# EAGLE design C64_3 (EAGLE 5.12)

## Sheet 1 of 3
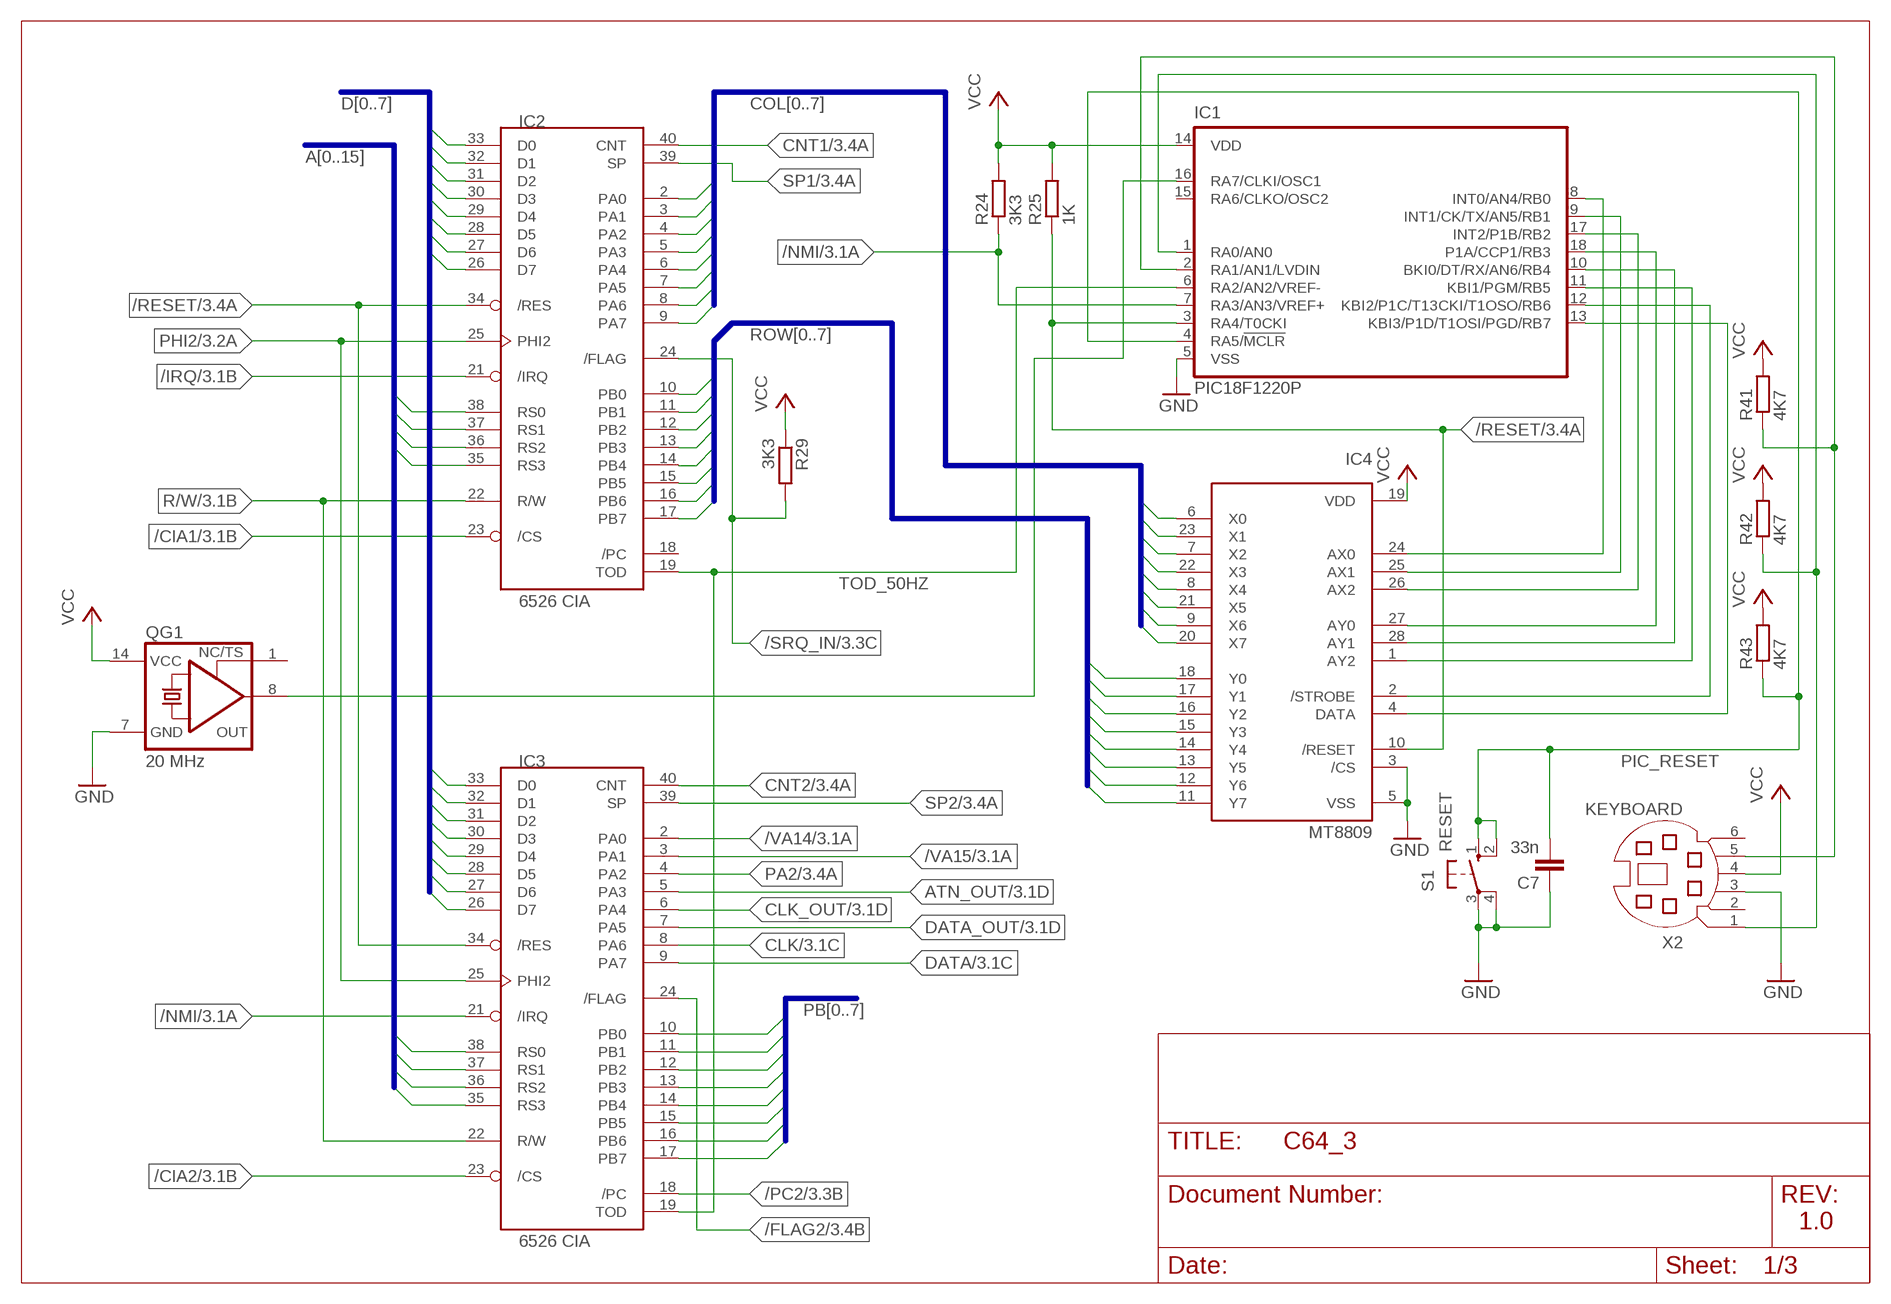
[diagram p0: schematic, sheet 1]

### Parts
C7  33n  C-EU050-024X044  [C050-024X044]
IC1  PIC18F1220P  [DIL18]
IC2  6526 CIA  6526  [DIP40]
IC3  6526 CIA  6526  [DIP40]
IC4  MT8809  [S28]
QG1  20 MHz  XO-14  [DIL14S]
R24  3K3  R-EU_0207/2V  [0207/2V]
R25  1K  R-EU_0207/2V  [0207/2V]
R29  3K3  R-EU_0207/2V  [0207/2V]
R41  4K7  R-EU_0207/2V  [0207/2V]
R42  4K7  R-EU_0207/2V  [0207/2V]
R43  4K7  R-EU_0207/2V  [0207/2V]
S1  RESET  10-XX  [B3F-10XX]
X2  KEYBOARD  MD06SS  [MDIN06SS]

### Nets
/CIA1: IC2.23(/CS) ; also sheet 3
/CIA2: IC3.23(/CS) ; also sheet 3
/FLAG2: IC3.24(/FLAG) ; also sheet 3
/IRQ: IC2.21(/IRQ) ; also sheet 3
/NMI: IC1.7(RA3/AN3/VREF+) IC3.21(/IRQ) R24.1 ; also sheet 3
/PC2: IC3.18(/PC) ; also sheet 3
/RESET: IC1.3(RA4/T0CKI) IC2.34(/RES) IC3.34(/RES) IC4.10(/RESET) R25.1 ; also sheet 3
/SRQ_IN: IC2.24(/FLAG) R29.2 ; also sheet 3
/STROBE: IC1.12(KBI2/P1C/T13CKI/T1OSO/RB6) IC4.2(/STROBE)
/VA14: IC3.2(PA0) ; also sheet 3
/VA15: IC3.3(PA1) ; also sheet 3
A0: IC2.38(RS0) IC3.38(RS0) ; also sheet 3
A1: IC2.37(RS1) IC3.37(RS1) ; also sheet 3
A2: IC2.36(RS2) IC3.36(RS2) ; also sheet 3
A3: IC2.35(RS3) IC3.35(RS3) ; also sheet 3
ATN_OUT: IC3.5(PA3) ; also sheet 3
AX0: IC1.8(INT0/AN4/RB0) IC4.24(AX0)
AX1: IC1.9(INT1/CK/TX/AN5/RB1) IC4.25(AX1)
AX2: IC1.17(INT2/P1B/RB2) IC4.26(AX2)
AY0: IC1.18(P1A/CCP1/RB3) IC4.27(AY0)
AY1: IC1.10(BKI0/DT/RX/AN6/RB4) IC4.28(AY1)
AY2: IC1.11(KBI1/PGM/RB5) IC4.1(AY2)
CLK: IC3.8(PA6) ; also sheet 3
CLK_OUT: IC3.6(PA4) ; also sheet 3
CNT1: IC2.40(CNT) ; also sheet 3
CNT2: IC3.40(CNT) ; also sheet 3
COL0: IC2.2(PA0) IC4.6(X0) ; also sheet 2
COL1: IC2.3(PA1) IC4.23(X1) ; also sheet 2
COL2: IC2.4(PA2) IC4.7(X2) ; also sheet 2
COL3: IC2.5(PA3) IC4.22(X3) ; also sheet 2
COL4: IC2.6(PA4) IC4.8(X4) ; also sheet 2
COL5: IC2.7(PA5) IC4.21(X5)
COL6: IC2.8(PA6) IC4.9(X6) ; also sheet 2
COL7: IC2.9(PA7) IC4.20(X7) ; also sheet 2
D0: IC2.33(D0) IC3.33(D0) ; also sheet 3
D1: IC2.32(D1) IC3.32(D1) ; also sheet 3
D2: IC2.31(D2) IC3.31(D2) ; also sheet 3
D3: IC2.30(D3) IC3.30(D3) ; also sheet 3
D4: IC2.29(D4) IC3.29(D4) ; also sheet 3
D5: IC2.28(D5) IC3.28(D5) ; also sheet 3
D6: IC2.27(D6) IC3.27(D6) ; also sheet 3
D7: IC2.26(D7) IC3.26(D7) ; also sheet 3
DATA: IC3.9(PA7) ; also sheet 3
DATA_OUT: IC3.7(PA5) ; also sheet 3
GND: C7.1 IC1.5(VSS) IC4.3(/CS) IC4.5(VSS) QG1.7(GND) S1.3(P) S1.4(P1) X2.3 ; also sheet 2,3
KB_CLOCK: IC1.2(RA1/AN1/LVDIN) R41.1 X2.5
KB_DATA: IC1.1(RA0/AN0) R42.1 X2.1
PA2: IC3.4(PA2) ; also sheet 3
PB0: IC3.10(PB0) ; also sheet 3
PB1: IC3.11(PB1) ; also sheet 3
PB2: IC3.12(PB2) ; also sheet 3
PB3: IC3.13(PB3) ; also sheet 3
PB4: IC3.14(PB4) ; also sheet 3
PB5: IC3.15(PB5) ; also sheet 3
PB6: IC3.16(PB6) ; also sheet 3
PB7: IC3.17(PB7) ; also sheet 3
PHI2: IC2.25(PHI2) IC3.25(PHI2) ; also sheet 3
PIC_CLK: IC1.16(RA7/CLKI/OSC1) QG1.8(OUT)
PIC_RESET: C7.2 IC1.4(RA5/!MCLR) R43.1 S1.1(S) S1.2(S1)
R/W: IC2.22(R/W) IC3.22(R/W) ; also sheet 3
ROW0: IC2.10(PB0) IC4.18(Y0) ; also sheet 2
ROW1: IC2.11(PB1) IC4.17(Y1) ; also sheet 2
ROW2: IC2.12(PB2) IC4.16(Y2) ; also sheet 2
ROW3: IC2.13(PB3) IC4.15(Y3) ; also sheet 2
ROW4: IC2.14(PB4) IC4.14(Y4) ; also sheet 2,3
ROW5: IC2.15(PB5) IC4.13(Y5)
ROW6: IC2.16(PB6) IC4.12(Y6)
ROW7: IC2.17(PB7) IC4.11(Y7)
SP1: IC2.39(SP) ; also sheet 3
SP2: IC3.39(SP) ; also sheet 3
SW_DATA: IC1.13(KBI3/P1D/T1OSI/PGD/RB7) IC4.4(DATA)
TOD_50HZ: IC1.6(RA2/AN2/VREF-) IC2.19(TOD) IC3.19(TOD)
VCC: IC1.14(VDD) IC4.19(VDD) QG1.14(VCC) R24.2 R25.2 R29.1 R41.2 R42.2 R43.2 X2.4 ; also sheet 2,3
Unconnected: IC1.15(RA6/CLKO/OSC2) IC2.18(/PC) QG1.1(TS) X2.2 X2.6

### Buses
D[0..7]
A[0..15]
COL[0..7]
ROW[0..7]
PB[0..7]

### Notes on the sheet
- 1.0

## Sheet 2 of 3
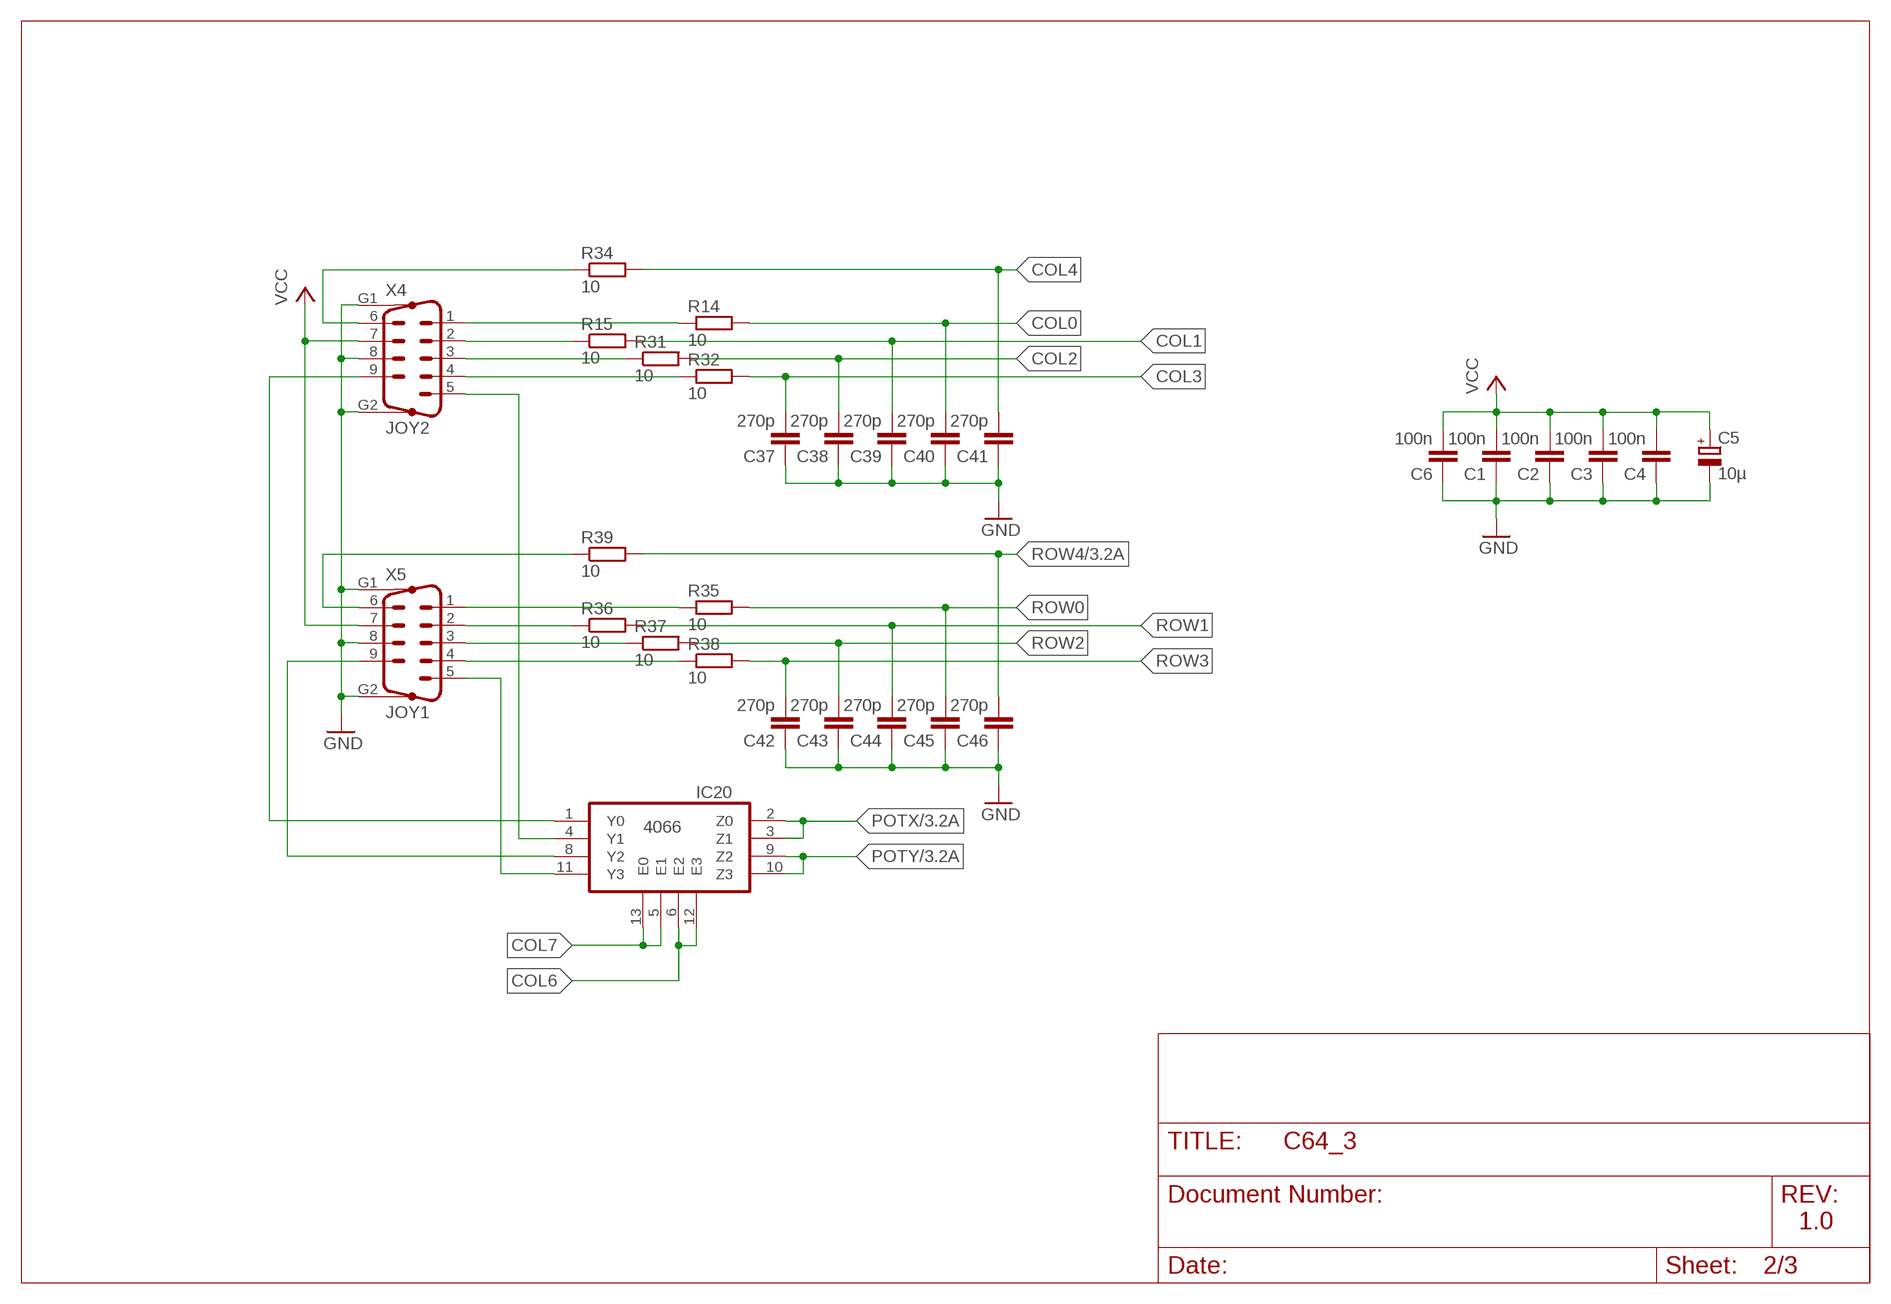
[diagram p1: schematic, sheet 2]

### Parts
C1  100n  C-EU050-024X044  [C050-024X044]
C2  100n  C-EU050-024X044  [C050-024X044]
C3  100n  C-EU050-024X044  [C050-024X044]
C4  100n  C-EU050-024X044  [C050-024X044]
C5  10µ  CPOL-EUE2.5-5  [E2,5-5]
C6  100n  C-EU050-024X044  [C050-024X044]
C37  270p  C-EU050-024X044  [C050-024X044]
C38  270p  C-EU050-024X044  [C050-024X044]
C39  270p  C-EU050-024X044  [C050-024X044]
C40  270p  C-EU050-024X044  [C050-024X044]
C41  270p  C-EU050-024X044  [C050-024X044]
C42  270p  C-EU050-024X044  [C050-024X044]
C43  270p  C-EU050-024X044  [C050-024X044]
C44  270p  C-EU050-024X044  [C050-024X044]
C45  270p  C-EU050-024X044  [C050-024X044]
C46  270p  C-EU050-024X044  [C050-024X044]
IC20  4066  [DIL14]
R14  10  R-EU_0207/2V  [0207/2V]
R15  10  R-EU_0207/2V  [0207/2V]
R31  10  R-EU_0207/2V  [0207/2V]
R32  10  R-EU_0207/2V  [0207/2V]
R34  10  R-EU_0207/2V  [0207/2V]
R35  10  R-EU_0207/2V  [0207/2V]
R36  10  R-EU_0207/2V  [0207/2V]
R37  10  R-EU_0207/2V  [0207/2V]
R38  10  R-EU_0207/2V  [0207/2V]
R39  10  R-EU_0207/2V  [0207/2V]
X4  JOY2  M09HP  [M09HP]
X5  JOY1  M09HP  [M09HP]

### Nets
BNTB: R34.1 X4.6
BTNA: R39.1 X5.6
COL0: C40.2 R14.2 ; also sheet 1
COL1: C39.2 R15.2 ; also sheet 1
COL2: C38.2 R31.2 ; also sheet 1
COL3: C37.2 R32.2 ; also sheet 1
COL4: C41.2 R34.2 ; also sheet 1
COL6: IC20.6(E2) IC20.12(E3) ; also sheet 1
COL7: IC20.5(E1) IC20.13(E0) ; also sheet 1
GND: C1.1 C2.1 C3.1 C4.1 C5.- C6.1 C37.1 C38.1 C39.1 C40.1 C41.1 C42.1 C43.1 C44.1 C45.1 C46.1 X4.8 X4.G1 X4.G2 X5.8 X5.G1 X5.G2 ; also sheet 1,3
JOYA0: R35.1 X5.1
JOYA1: R36.1 X5.2
JOYA2: R37.1 X5.3
JOYA3: R38.1 X5.4
JOYB0: R14.1 X4.1
JOYB1: R15.1 X4.2
JOYB2: R31.1 X4.3
JOYB3: R32.1 X4.4
POTAX: IC20.11(Y3) X5.5
POTAY: IC20.8(Y2) X5.9
POTBX: IC20.4(Y1) X4.5
POTBY: IC20.1(Y0) X4.9
POTX: IC20.2(Z0) IC20.3(Z1) ; also sheet 3
POTY: IC20.9(Z2) IC20.10(Z3) ; also sheet 3
ROW0: C45.2 R35.2 ; also sheet 1
ROW1: C44.2 R36.2 ; also sheet 1
ROW2: C43.2 R37.2 ; also sheet 1
ROW3: C42.2 R38.2 ; also sheet 1
ROW4: C46.2 R39.2 ; also sheet 1,3
VCC: C1.2 C2.2 C3.2 C4.2 C5.+ C6.2 X4.7 X5.7 ; also sheet 1,3

### Notes on the sheet
- 1.0

## Sheet 3 of 3
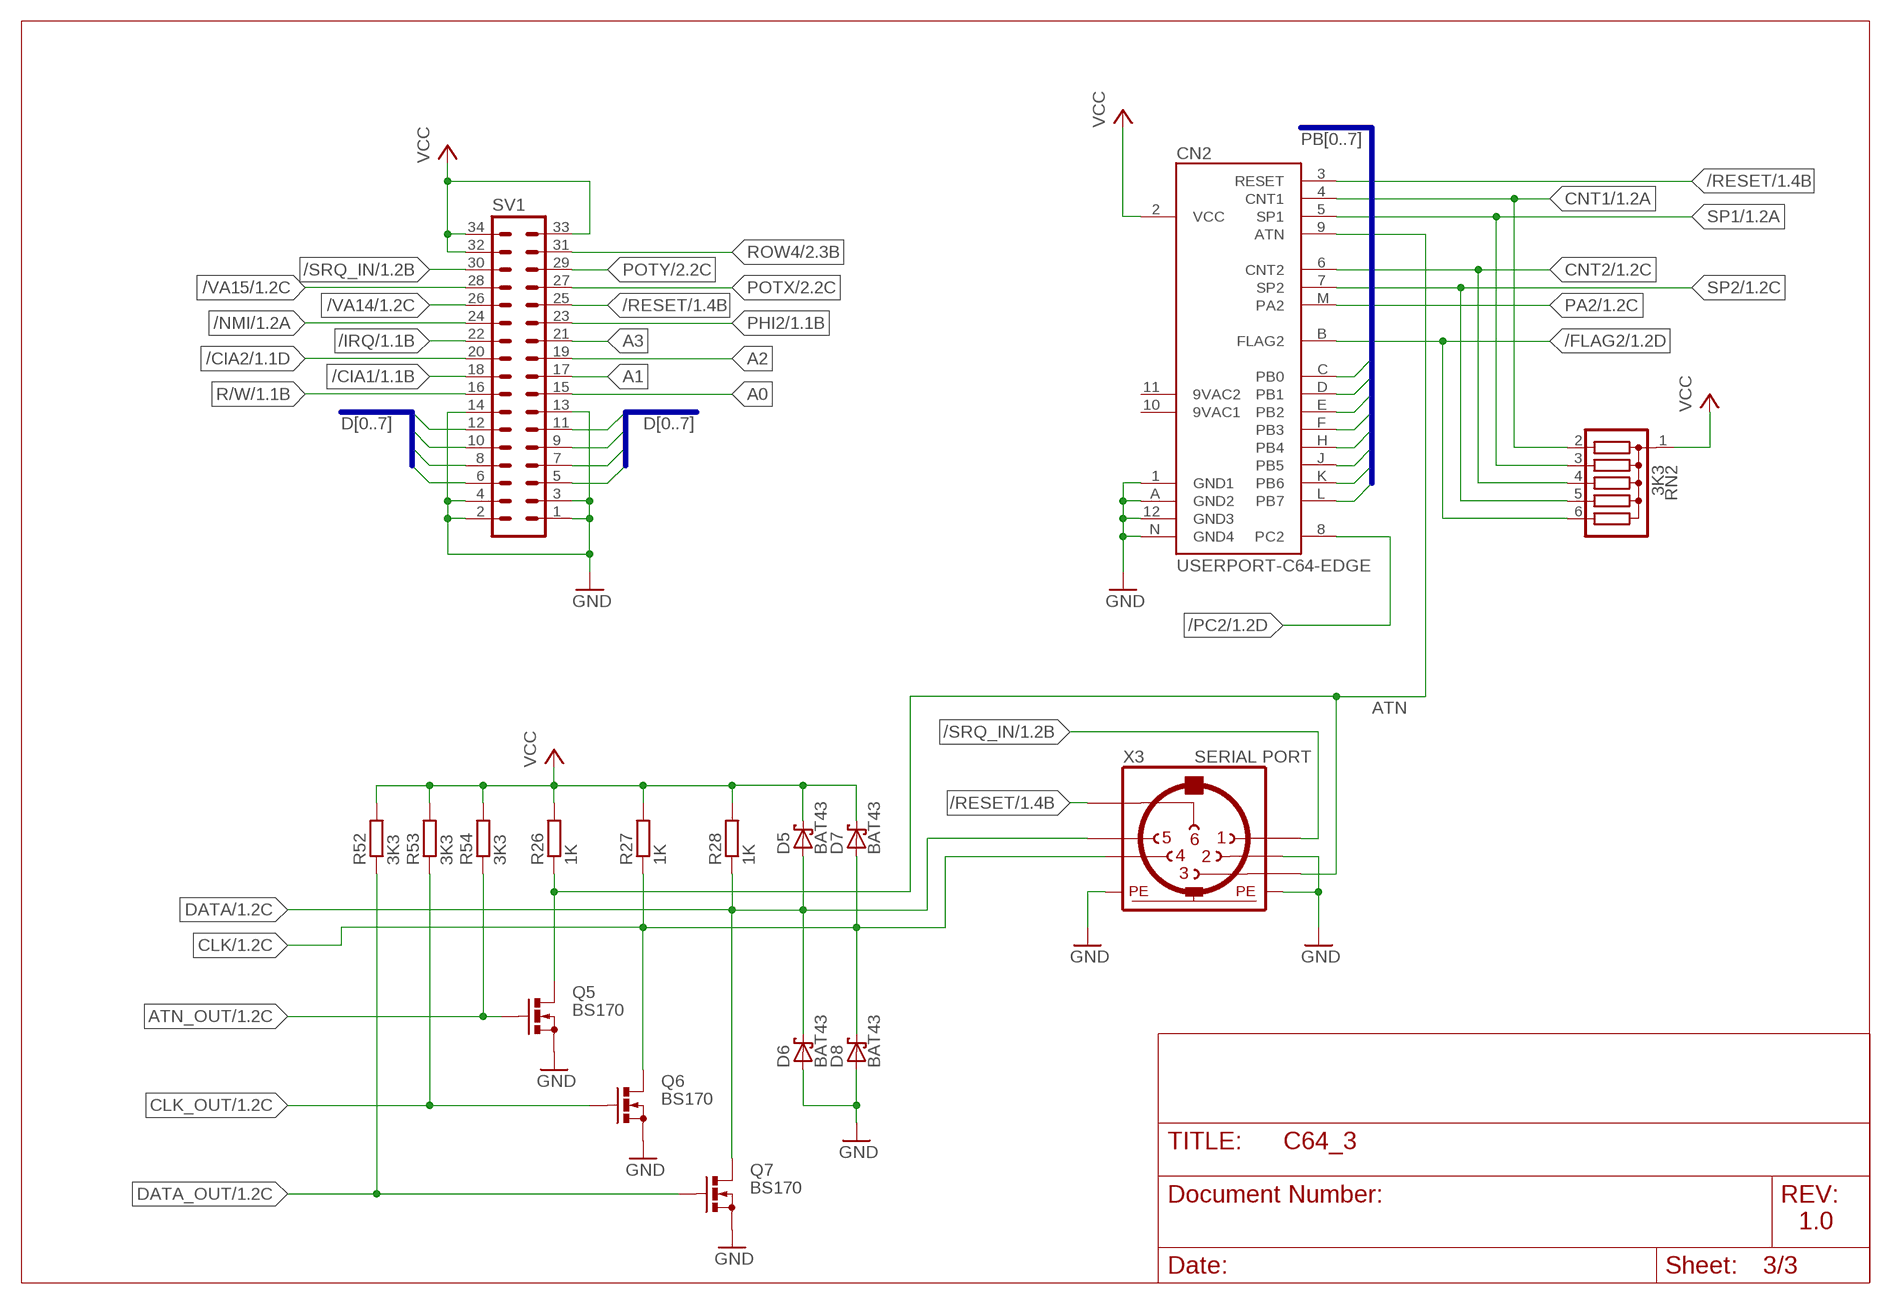
[diagram p2: schematic, sheet 3]

### Parts
CN2  USERPORT-C64-EDGE  [UPS24EDGE]
D5  BAT43  SCHOTTKY-DIODEDO35-7  [DO35-7]
D6  BAT43  SCHOTTKY-DIODEDO35-7  [DO35-7]
D7  BAT43  SCHOTTKY-DIODEDO35-7  [DO35-7]
D8  BAT43  SCHOTTKY-DIODEDO35-7  [DO35-7]
Q5  BS170  [SOT54E]
Q6  BS170  [SOT54E]
Q7  BS170  [SOT54E]
R26  1K  R-EU_0207/2V  [0207/2V]
R27  1K  R-EU_0207/2V  [0207/2V]
R28  1K  R-EU_0207/2V  [0207/2V]
R52  3K3  R-EU_0207/2V  [0207/2V]
R53  3K3  R-EU_0207/2V  [0207/2V]
R54  3K3  R-EU_0207/2V  [0207/2V]
RN2  3K3  G05R  [SIL6]
SV1  MA17-2  [MA17-2]
X3  SERIAL PORT  MAB6H  [MAB6H]

### Nets
/CIA1: SV1.18 ; also sheet 1
/CIA2: SV1.20 ; also sheet 1
/FLAG2: CN2.B(FLAG2) RN2.6 ; also sheet 1
/IRQ: SV1.22 ; also sheet 1
/NMI: SV1.24 ; also sheet 1
/PC2: CN2.8(PC2) ; also sheet 1
/RESET: CN2.3(RESET) SV1.25 X3.6 ; also sheet 1
/SRQ_IN: SV1.30 X3.1 ; also sheet 1
/VA14: SV1.26 ; also sheet 1
/VA15: SV1.28 ; also sheet 1
A0: SV1.15 ; also sheet 1
A1: SV1.17 ; also sheet 1
A2: SV1.19 ; also sheet 1
A3: SV1.21 ; also sheet 1
ATN: CN2.9(ATN) Q5.D R26.1 X3.3
ATN_OUT: Q5.G R54.1 ; also sheet 1
CLK: D7.A D8.C Q6.D R27.1 X3.4 ; also sheet 1
CLK_OUT: Q6.G R53.1 ; also sheet 1
CNT1: CN2.4(CNT1) RN2.2 ; also sheet 1
CNT2: CN2.6(CNT2) RN2.4 ; also sheet 1
D0: SV1.5 ; also sheet 1
D1: SV1.6 ; also sheet 1
D2: SV1.7 ; also sheet 1
D3: SV1.8 ; also sheet 1
D4: SV1.9 ; also sheet 1
D5: SV1.10 ; also sheet 1
D6: SV1.11 ; also sheet 1
D7: SV1.12 ; also sheet 1
DATA: D5.A D6.C Q7.D R28.1 X3.5 ; also sheet 1
DATA_OUT: Q7.G R52.1 ; also sheet 1
GND: CN2.1(GND1) CN2.12(GND3) CN2.A(GND2) CN2.N(GND4) D6.A D8.A Q5.S Q6.S Q7.S SV1.1 SV1.2 SV1.3 SV1.4 SV1.13 SV1.14 X3.2 X3.PE X3.PE@(PE) ; also sheet 1,2
PA2: CN2.M(PA2) ; also sheet 1
PB0: CN2.C(PB0) ; also sheet 1
PB1: CN2.D(PB1) ; also sheet 1
PB2: CN2.E(PB2) ; also sheet 1
PB3: CN2.F(PB3) ; also sheet 1
PB4: CN2.H(PB4) ; also sheet 1
PB5: CN2.J(PB5) ; also sheet 1
PB6: CN2.K(PB6) ; also sheet 1
PB7: CN2.L(PB7) ; also sheet 1
PHI2: SV1.23 ; also sheet 1
POTX: SV1.27 ; also sheet 2
POTY: SV1.29 ; also sheet 2
R/W: SV1.16 ; also sheet 1
ROW4: SV1.31 ; also sheet 1,2
SP1: CN2.5(SP1) RN2.3 ; also sheet 1
SP2: CN2.7(SP2) RN2.5 ; also sheet 1
VCC: CN2.2(VCC) D5.C D7.C R26.2 R27.2 R28.2 R52.2 R53.2 R54.2 RN2.1 SV1.32 SV1.33 SV1.34 ; also sheet 1,2
Unconnected: CN2.10(9VAC1) CN2.11(9VAC2)

### Buses
PB[0..7]
D[0..7]

### Notes on the sheet
- 1.0

## Power pins joined to a net without a drawn wire
GND: IC2.20(GND) IC3.20(GND) IC20.7(GND)
VCC: IC2.1(VCC) IC3.1(VCC) IC20.14(VCC)

## Library data of the parts
C1-C4 C6 C7 C37-C46 = rcl:C-EU: CAPACITOR, European symbol
C5 = rcl:CPOL-EU: POLARIZED CAPACITOR, European symbol
CN2 = 0RB_Commodore:USERPORT-C64-EDGE
D5-D8 = diode:SCHOTTKY-DIODE: Schottky Diode
IC1 = microchip:PIC18F1*20: 18/20/28-Pin High-Performance, Enhanced Flash Microcontrollers with 10-bit A/D and nanoWatt Technology Source: ww1.microchip.com/downloads/en/DeviceDoc/39605c.pdf; MF: MICROCHIP; MPN: PIC18F1220-I/P; OC_FARNELL: 9761977; OC_NEWARK: 92C2429
IC2 IC3 = 0RB_65xx:6526
IC4 = 0RB_CMOS:MT8809: Zarlink MT8809 8x8 Switch Array
IC20 = 0RB_CMOS:4066
Q5-Q7 = transistor-small-signal:BS170: N-CHANNEL MOS FET
QG1 = crystal:XO-: CRYSTAL; OC_FARNELL: unknown; OC_NEWARK: unknown
R14 R15 R24-R29 R31 R32 R34-R39 R41-R43 R52-R54 = rcl:R-EU_: RESISTOR, European symbol
RN2 = resistor-sil:G05R: SIL RESISTOR; OC_FARNELL: unknown; OC_NEWARK: unknown
S1 = switch-omron:10-XX: OMRON SWITCH; MPN: B3F-1000; OC_FARNELL: 176432; OC_NEWARK: 36M3542
SV1 = con-lstb:MA17-2: PIN HEADER; OC_FARNELL: unknown; OC_NEWARK: unknown
X2 = con-yamaichi:MD06SS: YAMAICHI CONNECTOR; OC_FARNELL: unknown; OC_NEWARK: unknown
X3 = con-hirschmann:MAB6H: Female CONNECTOR 6 pins with shield, horizontal (DIN 45322); MF: FARNELL; MPN: MAB 6 H; OC_FARNELL: 809901; OC_NEWARK: 67C7887
X4 X5 = con-subd:M09HP: SUB-D; OC_FARNELL: unknown; OC_NEWARK: unknown

## Board
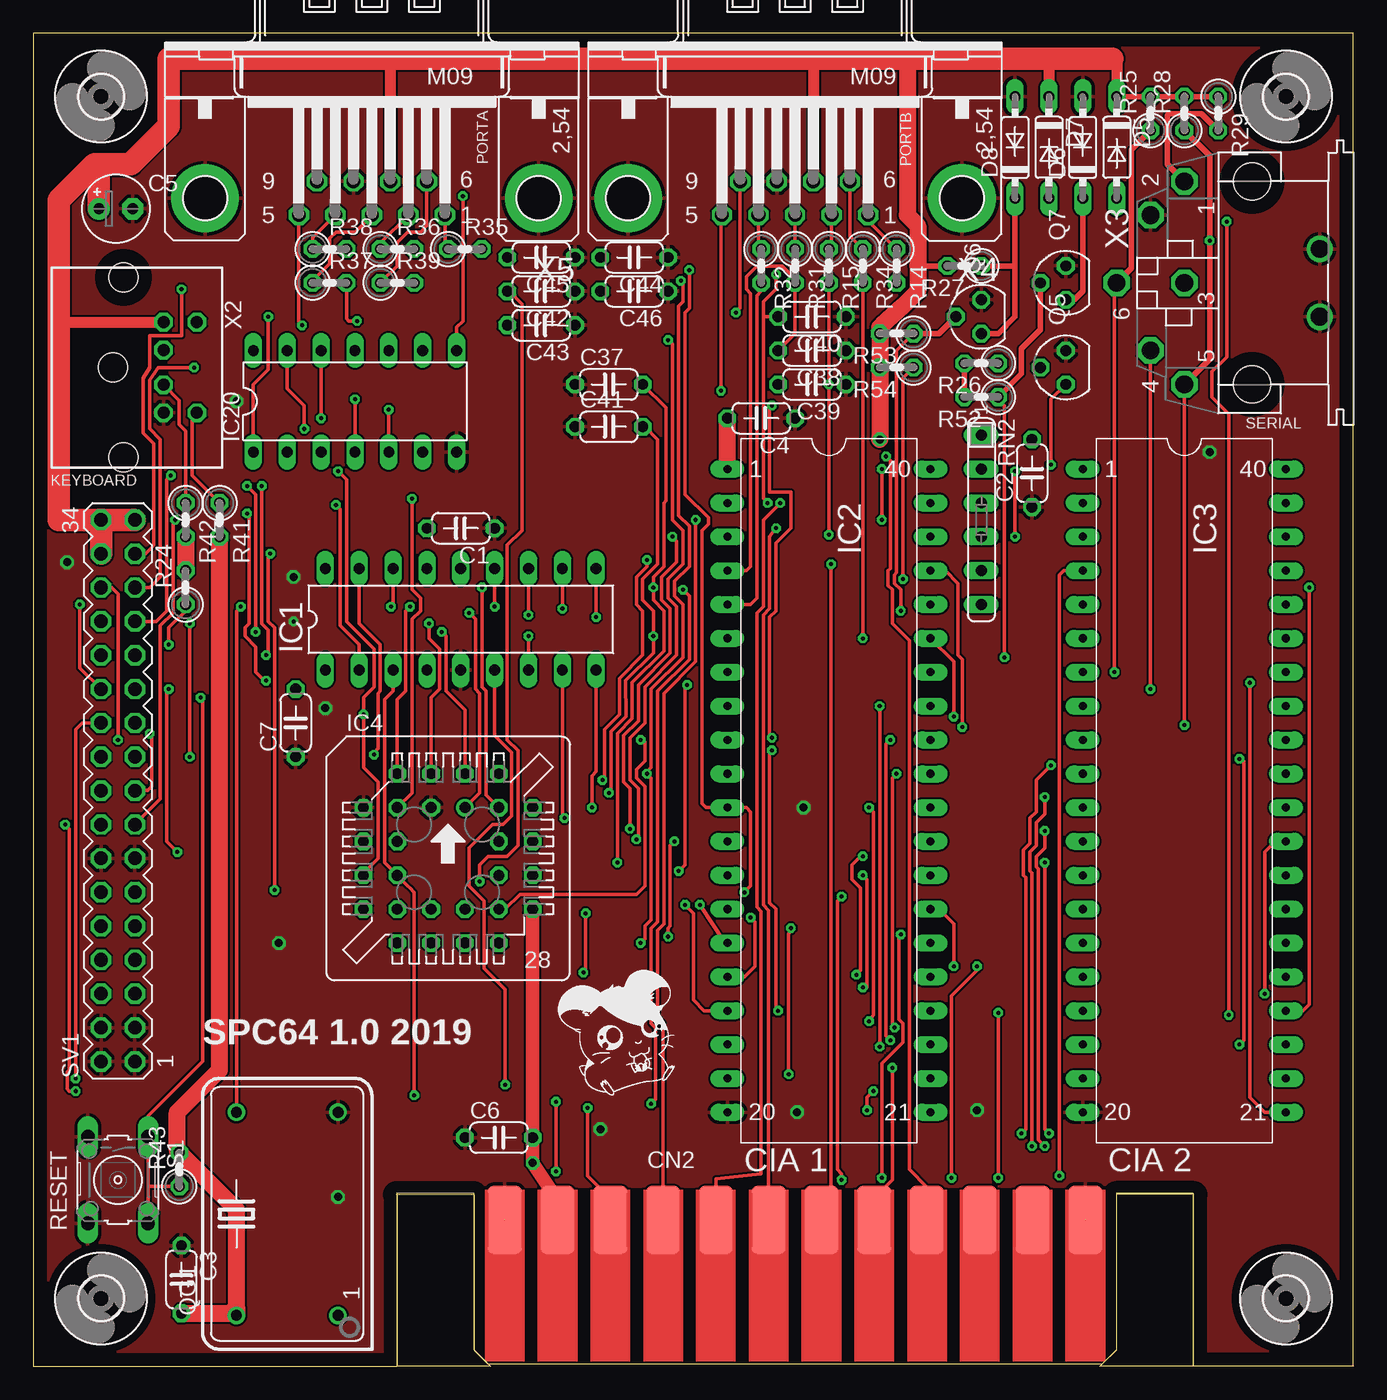
[diagram p3: board, top side]
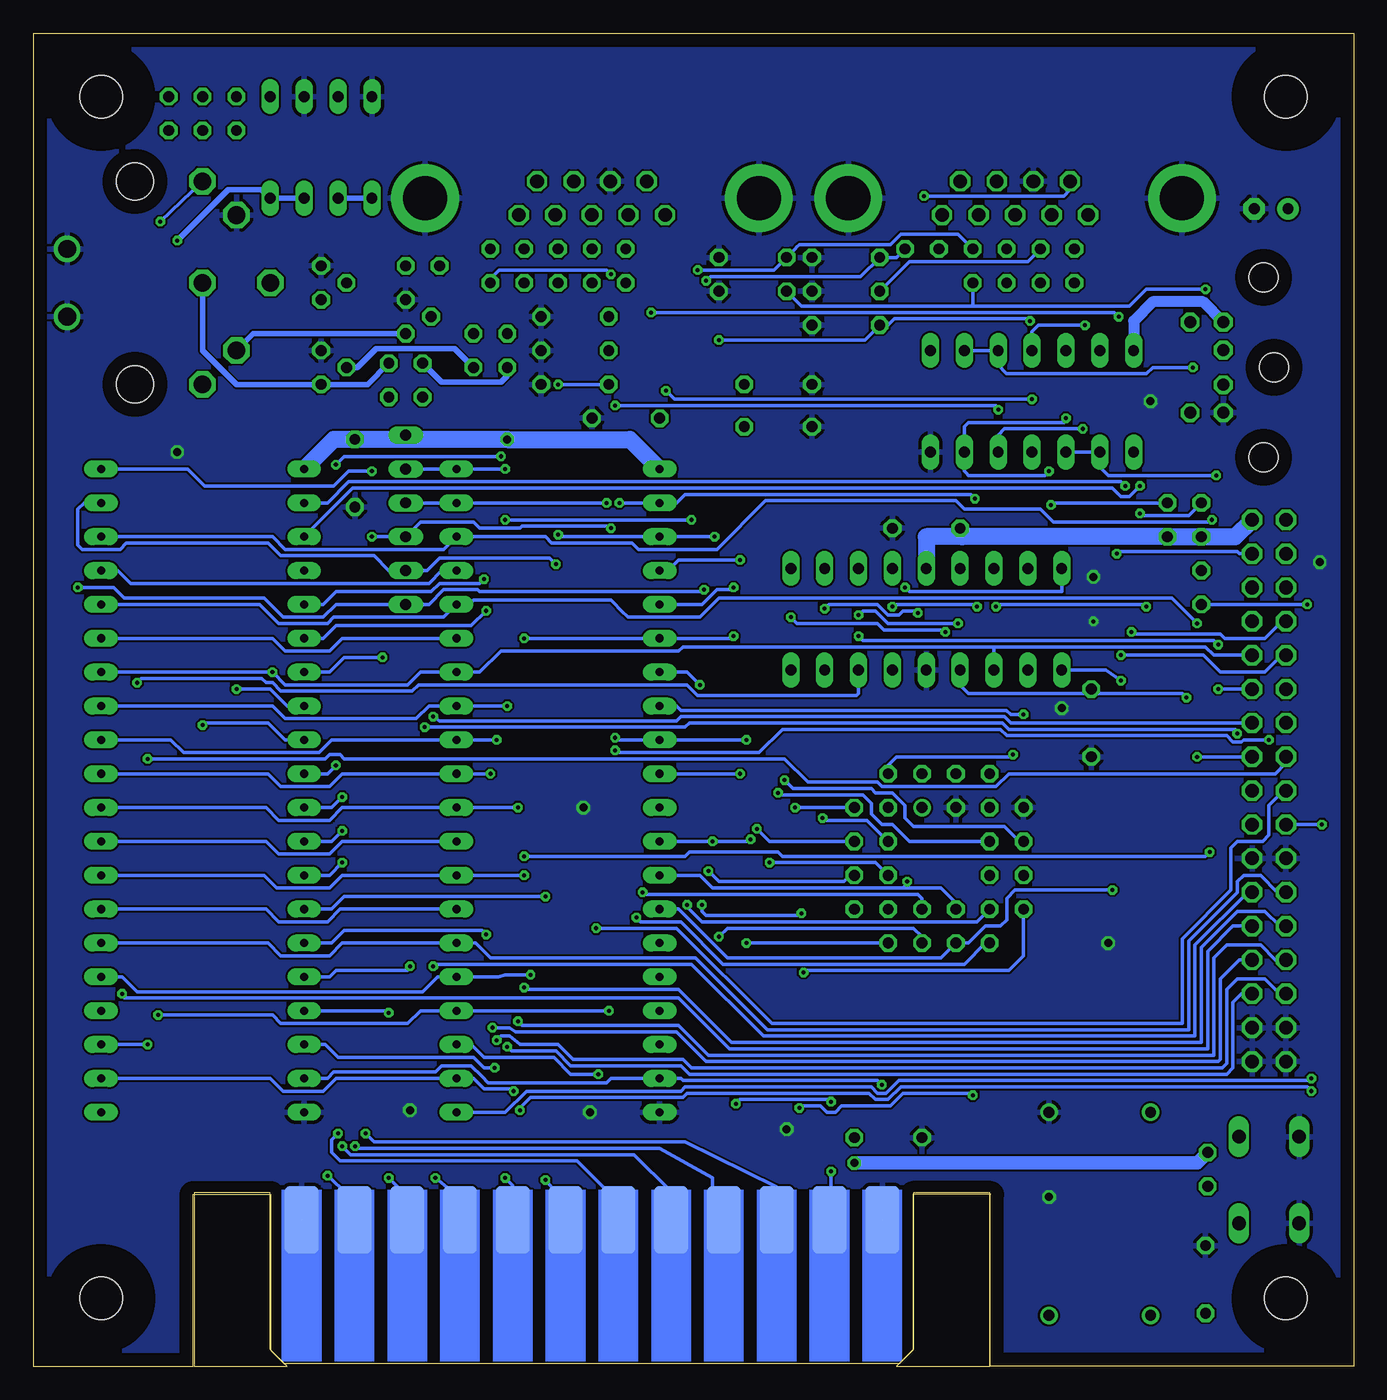
[diagram p4: board, bottom side, seen from below]

Size 99.06 x 100 mm. Coordinates in mm from the lower left corner, seen from the top.
Outline: 99.04,0 99.04,100 0,100 0,0 27.3,0 27.3,12.89
Outline: 99.06,0 87.07,0 87.07,12.88
Copper layers (1*16): Top 0.035mm / dielectric 1.5mm / Bottom 0.035mm
Design rules "default *": minimum track width 10mil, minimum drill 12mil, track to track 6mil, track to pad 6mil, pad to pad 6mil, via to via 6mil, smd to smd 6mil, copper to edge 40mil, drill to drill 8mil, minimum pad ring 10mil, minimum via ring 8mil, stop-mask expansion 4mil, vias tented up to drill 0mil, thermal gap 10mil
Milling: area 27.3,0 to 34.3,13; area 80,0 to 87,13

### Footprints (pad centres in the part's own frame; a part is rotated, then mirrored left to right if it is on the bottom)
C050-024X044 = drill 0.813 octagon: 1 -2.54,0; 2 2.54,0
E2,5-5 = drill 0.813 pad 1.6 round: + -1.27,0 | drill 0.813 pad 1.6 octagon: - 1.27,0
UPS24EDGE = smd 2.54 x 5.08: 1 -21.779,3.68; 2 -17.819,3.68; 3 -13.859,3.68; 4 -9.899,3.68; 5 -5.939,3.68; 6 -1.979,3.68; 7 1.981,3.68; 8 5.941,3.68; 9 9.901,3.68; 10 13.861,3.68; 11 17.821,3.68; 12 21.781,3.68 | smd 2.54 x 5.08 bottom: A -21.779,3.68; B -17.819,3.68; C -13.859,3.68; D -9.899,3.68; E -5.939,3.68; F -1.979,3.68; H 1.981,3.68; J 5.941,3.68; K 9.901,3.68; L 13.861,3.68; M 17.821,3.68; N 21.781,3.68
DO35-7 = drill 0.813 long: A 3.81,0; C -3.81,0
DIL18 = drill 0.813 long: 1 -10.16,-3.81; 2 -7.62,-3.81; 3 -5.08,-3.81; 4 -2.54,-3.81; 5 0,-3.81; 6 2.54,-3.81; 7 5.08,-3.81; 8 7.62,-3.81; 9 10.16,-3.81; 10 10.16,3.81; 11 7.62,3.81; 12 5.08,3.81; 13 2.54,3.81; 14 0,3.81; 15 -2.54,3.81; 16 -5.08,3.81; 17 -7.62,3.81; 18 -10.16,3.81
DIP40 = drill 0.61 pad 1.27 long: 1 -24.13,-7.62; 2 -21.59,-7.62; 3 -19.05,-7.62; 4 -16.51,-7.62; 5 -13.97,-7.62; 6 -11.43,-7.62; 7 -8.89,-7.62; 8 -6.35,-7.62; 9 -3.81,-7.62; 10 -1.27,-7.62; 11 1.27,-7.62; 12 3.81,-7.62; 13 6.35,-7.62; 14 8.89,-7.62; 15 11.43,-7.62; 16 13.97,-7.62; 17 16.51,-7.62; 18 19.05,-7.62; 19 21.59,-7.62; 20 24.13,-7.62; 21 24.13,7.62; 22 21.59,7.62; 23 19.05,7.62; 24 16.51,7.62; 25 13.97,7.62; 26 11.43,7.62; 27 8.89,7.62; 28 6.35,7.62; 29 3.81,7.62; 30 1.27,7.62; 31 -1.27,7.62; 32 -3.81,7.62; 33 -6.35,7.62; 34 -8.89,7.62; 35 -11.43,7.62; 36 -13.97,7.62; 37 -16.51,7.62; 38 -19.05,7.62; 39 -21.59,7.62; 40 -24.13,7.62
S28 = drill 0.813 round: 1 1.27,3.81 | drill 0.813 octagon: 2 -1.27,6.35; 3 -1.27,3.81; 4 -3.81,6.35; 5 -6.35,3.81; 6 -3.81,3.81; 7 -6.35,1.27; 8 -3.81,1.27; 9 -6.35,-1.27; 10 -3.81,-1.27; 11 -6.35,-3.81; 12 -3.81,-6.35; 13 -3.81,-3.81; 14 -1.27,-6.35; 15 -1.27,-3.81; 16 1.27,-6.35; 17 1.27,-3.81; 18 3.81,-6.35; 19 6.35,-3.81; 20 3.81,-3.81; 21 6.35,-1.27; 22 3.81,-1.27; 23 6.35,1.27; 24 3.81,1.27; 25 6.35,3.81; 26 3.81,6.35; 27 3.81,3.81; 28 1.27,6.35
DIL14 = drill 0.813 long: 1 -7.62,-3.81; 2 -5.08,-3.81; 3 -2.54,-3.81; 4 0,-3.81; 5 2.54,-3.81; 6 5.08,-3.81; 7 7.62,-3.81; 8 7.62,3.81; 9 5.08,3.81; 10 2.54,3.81; 11 0,3.81; 12 -2.54,3.81; 13 -5.08,3.81; 14 -7.62,3.81
SOT54E = drill 0.813 octagon: D -1.27,0; G 0,1.905; S 1.27,0
DIL14S = drill 0.813 round: 1 -7.62,-3.81; 7 7.62,-3.81; 8 7.62,3.81; 14 -7.62,3.81
0207/2V = drill 0.813 octagon: 1 -1.27,0; 2 1.27,0
SIL6 = drill 0.813 long: 1 -6.35,0; 2 -3.81,0; 3 -1.27,0; 4 1.27,0; 5 3.81,0; 6 6.35,0
B3F-10XX = drill 1.016 long: 1 -3.251,2.261; 2 3.251,2.261; 3 -3.251,-2.261; 4 3.251,-2.261
MA17-2 = drill 1.016 octagon: 1 -20.32,-1.27; 2 -20.32,1.27; 3 -17.78,-1.27; 4 -17.78,1.27; 5 -15.24,-1.27; 6 -15.24,1.27; 7 -12.7,-1.27; 8 -12.7,1.27; 9 -10.16,-1.27; 10 -10.16,1.27; 11 -7.62,-1.27; 12 -7.62,1.27; 13 -5.08,-1.27; 14 -5.08,1.27; 15 -2.54,-1.27; 16 -2.54,1.27; 17 0,-1.27; 18 0,1.27; 19 2.54,-1.27; 20 2.54,1.27; 21 5.08,-1.27; 22 5.08,1.27; 23 7.62,-1.27; 24 7.62,1.27; 25 10.16,-1.27; 26 10.16,1.27; 27 12.7,-1.27; 28 12.7,1.27; 29 15.24,-1.27; 30 15.24,1.27; 31 17.78,-1.27; 32 17.78,1.27; 33 20.32,-1.27; 34 20.32,1.27
3,2 = hole 3.2: 0,0
MDIN06SS = drill 0.9 octagon: 1 1.3,8.5; 2 -1.3,8.5; 3 3.4,8.5; 4 -3.4,8.5; 5 3.4,11; 6 -3.4,11 | hole 2.2: -6.75,5.5; 0,4.7; 6.75,5.5
MAB6H = drill 1.321 octagon: 1 7.62,5.08; 2 5.08,7.62; 3 0,5.08; 4 -5.08,7.62; 5 -7.62,5.08; 6 0,10.16 | drill 1.321 round: PE -2.54,-5.08; PE@ 2.54,-5.08 | hole 2.794: 7.62,0; -7.62,0
M09HP = drill 1.016 octagon: 1 -5.486,1.27; 2 -2.743,1.27; 3 0,1.27; 4 2.743,1.27; 5 5.486,1.27; 6 -4.115,-1.27; 7 -1.372,-1.27; 8 1.372,-1.27; 9 4.115,-1.27 | drill 3.302 pad 5.08 round: G1 -12.522,0; G2 12.522,0

### Placement (x,y rotation side)
C1  32.07,62.87 180 top
C2  74.93,66.99 90 top
C3  11.11,6.51 270 top
C4  54.61,71.12 180 top
C5  6.19,86.84 0 top
C6  34.92,17.14 0 top
C7  19.68,48.26 90 top
C37  43.18,73.66 0 top
C38  58.42,76.2 180 top
C39  58.42,73.66 180 top
C40  58.42,78.74 180 top
C41  43.18,70.48 0 top
C42  38.1,80.64 180 top
C43  38.1,78.11 180 top
C44  45.09,83.19 180 top
C45  38.1,83.19 180 top
C46  45.09,80.64 180 top
CN2  57.15,7.3 0 top
D5  81.28,91.44 270 top
D6  78.74,91.44 90 top
D7  76.2,91.44 270 top
D8  73.66,91.44 90 top
IC1  32.07,56.04 0 top
IC2  59.69,43.18 270 top
IC3  86.36,43.18 270 top
IC4  31.11,38.1 0 top
IC20  24.13,72.39 0 top
Q5  77.47,74.93 90 top
Q6  71.12,78.74 90 top
Q7  77.47,81.28 90 top
QG1  19.05,11.43 90 top
R14  64.77,82.55 270 top
R15  59.69,82.55 270 top
R24  11.43,58.42 90 top
R25  83.82,93.98 90 top
R26  71.12,75.25 180 top
R27  69.85,82.55 180 top
R28  86.36,93.98 90 top
R29  88.9,93.98 270 top
R31  57.15,82.55 270 top
R32  54.61,82.55 270 top
R34  62.23,82.55 270 top
R35  32.38,83.82 0 top
R36  27.3,83.82 0 top
R37  22.23,81.28 0 top
R38  22.23,83.82 0 top
R39  27.3,81.28 0 top
R41  13.97,63.5 270 top
R42  11.43,63.5 270 top
R43  10.95,14.76 90 top
R52  71.12,72.71 180 top
R53  64.77,77.47 180 top
R54  64.77,74.93 180 top
RN2  71.12,63.5 270 top
S1  6.35,13.97 270 top
SV1  6.35,43.18 90 top
U$1  [3,2]  5.08,95.25 0 top
U$2  [3,2]  5.08,5.08 0 top
U$3  [3,2]  93.98,5.08 0 top
U$4  [3,2]  93.98,95.25 0 top
X2  1.27,74.93 270 top
X3  91.44,81.28 90 top
X4  57.15,87.63 180 top
X5  25.4,87.63 180 top

### Tracks (layer width: path | path; a pad name or v marks a point on that pad's centre or on a via)
/CIA1  (via drill 0.3)
  Top 0.254: v56.67,21.91 56.67,32.38 v56.83,32.86
  Bottom 0.254: SV1.18 5.24,43.18 6.35,42.07 6.35,39.85 6.83,39.37 8.73,39.37 9.21,38.89 9.21,35.72 12.86,32.07 12.86,25.72 43.66,25.72 50.8,32.86 v56.83,32.86 | v56.67,21.91 58.74,21.91 60.01,23.18 65.25,23.18 66.2,24.13 IC2.23
/CIA2  (via drill 0.3)
  Top 0.254: v90.49,45.56 90.65,45.56 90.81,45.4 90.81,24.45 v90.49,24.13
  Bottom 0.254: SV1.20 5.08,45.24 5.87,44.45 24.45,44.45 25.88,44.45 26.83,43.5 35.4,43.5 35.72,43.81 40.96,43.81 42.7,45.56 75.72,45.56 76.04,45.88 76.83,45.88 77.15,45.56 v90.49,45.56 | v90.49,24.13 IC3.23
/FLAG2  (via drill 0.3)
  Top 0.254: IC3.24 95.25,26.67 95.73,27.15 v95.73,58.42 | v48.74,58.26 | v48.74,58.26 49.21,57.78 49.21,53.02 46.83,50.64 46.83,35.4 46.83,33.34 46.51,33.02 | 46.51,33.02 | 46.51,33.02 46.35,32.86 46.35,25.72 46.67,25.4 46.67,20 v46.35,19.68 | v39.21,14.61 v39.21,19.84
  Bottom 0.254: v95.73,58.42 93.03,58.42 92.23,57.63 81.76,57.63 80.33,56.2 77.31,56.2 76.36,57.15 RN2.6 69.37,57.15 68.26,58.26 65.72,58.26 65.56,58.1 49.05,58.1 48.9,58.26 v48.74,58.26 | v46.35,19.68 46.04,20 39.37,20 v39.21,19.84 | v39.21,14.61 39.21,11.1 CN2.B
/IRQ  (via drill 0.3)
  Top 0.254: v3.17,21.59 3.17,47.78 3.65,48.26 SV1.22
  Bottom 0.254: v3.17,21.59 3.33,21.43 34.13,21.43 35.08,20.48 35.72,20.48 36.2,20.95 50.16,20.95 50.48,20.64 62.07,20.64 63.66,19.05 IC2.21
/NMI  (via drill 0.3)
  Top 0.254: v3.49,57.15 3.49,52.39 SV1.24 | R24.1 11.43,56.67 10.16,55.4 v10.16,54.13 | v37.15,54.77 IC1.7 | v91.28,51.28 91.28,20.16 92.39,19.05 93.66,19.05 IC3.21
  Bottom 0.254: v3.49,57.15 R24.1 | v10.16,54.13 10.48,54.45 36.83,54.45 v37.15,54.77 | IC1.7 37.15,50.48 37.31,50.32 49.21,50.32 50.01,51.12 70.17,51.12 70.64,50.64 80.49,50.64 81.12,51.28 81.6,51.28 81.92,51.59 90.96,51.59 v91.28,51.28
/PC2  (via drill 0.3)
  Top 0.254: CN2.8 63.09,12.61 64.45,13.97 v64.45,22.38
  Bottom 0.254: v64.45,22.38 65.25,22.38 66.04,23.18 76.2,23.18 77.15,24.13 IC3.18
/RESET  (via drill 0.3)
  Top 0.254: X3.6 81.12,81.12 v81.12,52.07 | IC4.10 26.35,37.78 26.35,50.01 26.99,50.64 IC1.3 | IC4.10 | 28.1,36.04 IC4.10 | 28.1,36.04 | 28.26,35.88 28.1,36.04 | 28.26,35.88 | 28.26,35.88 28.57,35.56 v28.57,20.32 | v41.59,19.37 41.59,14.29 43.29,12.59 CN2.3
  Top 0.406: R25.1 82.39,91.28 82.39,82.39 X3.6
  Bottom 0.254: IC3.34 v81.12,52.07 80.17,51.12 70.96,51.12 70.01,52.07 IC2.34 65.56,52.07 63.98,53.66 50.64,53.66 50.32,53.98 26.99,53.98 | IC1.3 26.99,53.98 | SV1.25 10.48,53.34 11.11,53.98 26.99,53.98 | v28.57,20.32 28.42,20.48 33.81,20.48 34.77,19.53 38.42,19.53 38.89,19.05 39.53,19.05 40.01,19.53 41.43,19.53 v41.59,19.37
/SRQ_IN  (via drill 0.3)
  Top 0.254: v89.69,26.35 89.69,71.44 88.42,72.71 88.42,74.61 89.53,75.72 v89.53,85.88 | v55.88,26.67 | v55.88,26.67 55.72,26.83 55.72,34.29 55.24,34.77 55.24,46.04 v55.4,46.2 | SV1.30 5.87,58.42 6.35,57.94 v6.35,46.99 | R29.2
  Top 0.406: R29.2 87.63,93.98 85.25,93.98 85.09,93.82 85.09,90.17 X3.1
  Bottom 0.254: v89.53,85.88 X3.1 | v89.69,26.35 81.12,26.35 80.49,25.72 70.96,25.72 70.01,26.67 IC2.24 v55.88,26.67 | v6.35,46.99 8.26,46.99 8.41,46.83 9.05,46.83 9.53,47.31 26.04,47.31 26.51,47.78 42.86,47.78 44.61,46.04 55.24,46.04 v55.4,46.2
/STROBE  (via drill 0.3)
  Top 0.254: IC4.2 29.84,50.16 30.48,50.8 30.48,53.82 29.69,54.61 v29.69,55.72 | v37.15,56.36 IC1.12
  Bottom 0.254: v29.69,55.72 34.92,55.72 35.88,56.67 36.83,56.67 v37.15,56.36
/VA14  (via drill 0.3)
  Top 0.254: v17.46,53.34 17.62,53.5 17.62,55.24 17.14,55.72 v17.14,66.04
  Bottom 0.254: IC3.2 76.99,64.77 75.41,66.36 17.46,66.36 v17.14,66.04 | SV1.26 5.4,53.34 6.67,52.07 9.37,52.07 10,52.07 11.27,53.34 v17.46,53.34
/VA15  (via drill 0.3)
  Top 0.254: v16.03,66.04 16.67,65.41 v16.67,55.09
  Bottom 0.254: IC3.3 | IC3.3 75.09,65.88 18.1,65.88 | SV1.28 5.4,55.88 6.67,54.61 9.68,54.61 10,54.93 16.51,54.93 v16.67,55.09 | 18.1,65.88 17.46,65.25 16.83,65.25 v16.03,66.04 | 18.1,65.88
A0  (via drill 0.3)
  Top 0.254: v10.64,63.5 10.48,63.34 10.48,56.52 9.53,55.56 9.53,42.55 SV1.15
  Bottom 0.254: IC3.38 81.12,62.23 80.17,61.28 68.26,61.28 IC2.38 60.64,62.23 60.17,61.75 54.13,61.75 53.66,61.28 47.78,61.28 44.13,64.93 29.84,64.93 29.21,64.29 23.5,64.29 22.54,63.34 21.27,63.34 20.64,63.34 15.88,63.34 15.56,63.34 10.79,63.34 v10.64,63.5
A1  (via drill 0.3)
  Top 0.254: SV1.17 8.57,43.18 8.89,43.5 8.89,47.31 v8.73,47.47 | v69.69,47.94 69.69,53.02 69.37,53.34 69.37,58.74 68.42,59.69 IC2.37
  Bottom 0.254: IC3.37 92.71,59.69 91.76,58.74 69.37,58.74 68.42,59.69 IC2.37 | v8.73,47.47 8.73,47.62 8.89,47.78 25.88,47.78 26.35,48.26 49.85,48.26 50.16,47.94 v69.69,47.94
A2  (via drill 0.3)
  Top 0.254: v11.75,45.72 v11.75,55.72
  Bottom 0.254: IC3.36 82.07,57.15 80.64,55.72 76.99,55.72 76.52,56.2 68.26,56.2 IC2.36 66.36,57.15 66.04,57.47 55.72,57.47 54.77,56.52 | 54.77,56.52 | 54.61,56.36 54.77,56.52 | 54.61,56.36 | 54.61,56.36 54.45,56.2 49.05,56.2 47.62,57.63 13.65,57.63 v11.75,55.72 | SV1.19 v11.75,45.72
A3  (via drill 0.3)
  Top 0.254: v69.06,48.74 69.06,52.86 IC2.35
  Bottom 0.254: IC3.35 81.12,54.61 80.17,53.66 76.83,53.66 75.88,54.61 IC2.35 | SV1.21 25.72,48.26 26.19,48.74 50.48,48.74 50.8,48.42 68.58,48.42 v69.06,48.74
ATN  (via drill 0.3)
  Top 0.254: CN2.9 67.05,13.44 65.72,14.76 65.72,54.45 64.45,55.72 64.45,58.26 64.14,58.58 64.14,59.69 64.29,59.85 64.29,67.94 v63.98,68.26 | v76.36,67.63 76.36,72.55 Q5.D
  Bottom 0.254: v63.98,68.26 75.72,68.26 v76.36,67.63
  Bottom 0.406: X3.3 86.36,76.2 83.82,73.66 Q5.D 73.98,73.66 R26.1
ATN_OUT  (via drill 0.3)
  Top 0.254: v65.25,59.05 65.25,74.14 R54.1
  Bottom 0.254: IC3.5 77.31,57.15 76.36,58.1 69.22,58.1 68.58,58.74 65.56,58.74 v65.25,59.05
  Bottom 0.406: Q5.G 74.77,74.93 73.34,76.36 67.47,76.36 R54.1
AX0  (via drill 0.3)
  Top 0.254: IC1.8 39.69,41.27 v39.85,41.12
  Bottom 0.254: v39.85,41.12 39.69,40.96 36.51,40.96 IC4.24
AX1  (via drill 0.3)
  Top 0.254: v41.91,41.91 41.91,44.29 42.23,44.61 IC1.9
  Bottom 0.254: IC4.25 v41.91,41.91
AX2  (via drill 0.3)
  Top 0.254: v25.56,45.88 25.56,46.04 25.72,46.2 | 25.72,46.2 | 25.72,46.2 25.88,46.35 25.88,50.48 26.04,50.64 26.04,54.13 24.45,55.72 IC1.17
  Bottom 0.254: IC4.26 34.92,45.09 34.29,45.72 25.72,45.72 v25.56,45.88
AY0  (via drill 0.3)
  Top 0.254: IC4.27 33.97,42.86 33.97,50.64 33.66,50.96 v33.66,58.42
  Bottom 0.254: v33.66,58.42 33.34,58.1 21.91,58.1 IC1.18
AY1  (via drill 0.3)
  Top 0.254: IC4.28 32.38,49.21 30.96,50.64 30.96,54.77 v30.64,55.09 | v42.23,56.2 IC1.10
  Bottom 0.254: v30.64,55.09 30.96,55.24 35.24,55.24 35.72,55.72 41.75,55.72 v42.23,56.2
AY2  (via drill 0.3)
  Top 0.254: IC4.1 33.5,43.02 33.5,50.48 33.18,50.8 33.18,56.04 v32.7,56.52 | v39.69,56.83 IC1.11
  Bottom 0.254: v32.7,56.52 32.86,56.67 33.81,56.67 34.13,56.36 34.92,56.36 35.72,57.15 39.37,57.15 v39.69,56.83
BNTB
  Top 0.254: X4.6 61.27,84.78 R34.1
BTNA
  Top 0.254: X5.6 29.52,85.55 29.05,85.09 28.1,85.09 27.3,84.3 27.3,82.55 R39.1
CLK  (via drill 0.3)
  Top 0.254: v83.82,50.8 X3.4
  Top 0.406: Q6.D 72.39,77.47 73.66,78.74 73.66,82.55 | 73.66,82.55 D8.C | 73.66,82.55 R27.1
  Bottom 0.254: v83.82,50.8 81.28,50.8 80.01,49.53 IC3.8
  Bottom 0.406: D8.C D7.A | X3.4 82.55,77.47 Q6.D
CLK_OUT  (via drill 0.3)
  Top 0.254: v65.09,56.67 65.09,58.26 64.61,58.74 64.61,59.37 64.77,59.53 64.77,76.2 R53.1
  Top 0.406: R53.1 67.94,77.47 Q6.G
  Bottom 0.254: IC3.6 77.31,54.61 76.36,55.56 66.2,55.56 v65.09,56.67
CNT1  (via drill 0.3)
  Top 0.254: v49.69,63.5 49.69,63.02 49.69,52.86 47.31,50.48 47.31,33.18 46.83,32.7 46.83,26.19 47.25,25.77 47.25,13.55 47.31,13.49 47.31,11.04 CN2.4 | v63.66,63.5 v63.66,67.31
  Bottom 0.254: RN2.2 IC2.40 v63.66,67.31 | v49.69,63.5 v63.66,63.5
CNT2  (via drill 0.3)
  Top 0.254: v73.66,67.15 73.66,62.39 v73.66,62.23 | CN2.6 55.17,34.2 54.77,34.61 54.77,56.36 55.24,56.83 55.24,62.23 v55.72,62.87
  Bottom 0.254: IC3.40 87.47,67.31 86.2,66.04 76.52,66.04 75.41,67.15 v73.66,67.15 | v73.66,62.23 RN2.4 70.01,63.34 66.04,63.34 65.56,62.87 62.55,62.87 62.39,63.02 56.04,63.02 v55.72,62.87
COL0  (via drill 0.3)
  Top 0.254: v55.72,81.92 55.72,80.8 54.77,79.85 54.77,78.74 | 54.77,78.74 54.77,65.09 v55.09,64.77 | 54.77,78.74 C40.2 | v28.42,65.09 28.42,58.26 29.05,57.63 29.05,56.67 28.42,56.04 28.42,43.02 IC4.6
  Bottom 0.254: R14.2 64.77,81.6 64.14,82.23 56.04,82.23 v55.72,81.92 | v55.09,64.77 IC2.2 50.8,64.77 50.16,65.41 28.73,65.41 v28.42,65.09
COL1  (via drill 0.3)
  Top 0.254: v59.69,62.39 v59.69,73.66 R15.2 | v44.77,40.32 44.77,43.34 44.29,43.81 44.29,47.31 45.4,48.42 45.4,51.12 47.78,53.5 47.78,56.83 47.15,57.47 47.15,59.21 48.26,60.33 48.26,61.91 v47.94,62.23
  Bottom 0.254: v59.69,62.39 | v59.69,62.39 59.53,62.23 IC2.3 v47.94,62.23 | v59.69,73.66 C39.2 | IC4.23 43.81,39.37 v44.77,40.32
COL2  (via drill 0.3)
  Top 0.254: IC2.4 53.5,59.69 53.82,60.01 53.82,80.49 53.5,80.8 53.5,81.76 54.29,82.55 56.2,82.55 57.15,81.6 R31.2 57.15,77.47 C38.2 | v42.7,43.97 42.86,44.13 42.86,47.78 43.97,48.9 43.97,51.59 45.72,53.34 45.72,56.67 45.24,57.15 45.24,59.21 46.04,60.01 v46.04,60.48
  Bottom 0.254: IC4.7 25.08,39.37 26.19,40.48 33.02,40.48 33.66,41.12 33.66,42.07 34.61,43.02 | 34.61,43.02 | 34.61,43.02 35.88,43.02 36.2,43.34 42.07,43.34 v42.7,43.97 | v46.04,60.48 50.64,60.48 51.44,59.69 IC2.4
COL3  (via drill 0.3)
  Top 0.254: R32.2 54.61,80.64 54.29,80.33 54.29,57.63 53.82,57.15 IC2.5 | v46.51,58.42 | v46.51,58.42 46.51,57.47 47.31,56.67 47.31,53.66 44.93,51.28 44.93,48.58 43.81,47.47 v43.81,37.78 | C37.2 47.47,71.91 47.47,64.93 47.31,64.77 47.31,60.01 46.51,59.21 v46.51,58.42
  Bottom 0.254: IC2.5 48.9,57.15 47.78,58.26 46.67,58.26 v46.51,58.42 | v43.81,37.78 35.88,37.78 IC4.22
COL4  (via drill 0.3)
  Top 0.254: v62.23,54.61 R34.2 | v43.18,43.02 | v43.18,43.02 43.34,43.18 43.34,47.62 44.45,48.74 44.45,51.44 46.51,53.5 v46.51,54.77 46.51,56.67 45.72,57.47 45.72,59.05 46.83,60.17 46.83,69.53 45.88,70.48 C41.2
  Bottom 0.254: v62.23,54.61 IC2.6 46.67,54.61 v46.51,54.77 | IC4.8 33.34,39.37 34.61,40.64 35.4,40.64 36.2,41.43 36.2,42.23 36.83,42.86 43.02,42.86 v43.18,43.02 | v46.51,54.77
COL5  (via drill 0.3)
  Top 0.254: v48.42,37.15 48.74,37.47 | 48.74,37.47 | 48.74,37.47 48.9,37.62 48.9,50.96 v49.05,51.12
  Bottom 0.254: IC4.21 37.78,36.83 38.26,36.35 47.62,36.35 v48.42,37.15 | v49.05,51.12 50.01,52.07 51.75,52.07 IC2.7
COL6  (via drill 0.3)
  Top 0.254: v21.59,71.12 IC20.12 | IC4.9 24.77,36.99 25.72,37.94 | 25.72,37.94 | 25.72,37.94 25.88,38.1 25.88,43.81 24.77,44.93 v24.77,48.9 24.77,50.16 25.56,50.96 25.56,53.82 23.5,55.88 23.5,63.82 23.5,63.98 23.5,66.52 v22.86,67.15
  Bottom 0.254: v21.59,71.12 21.59,70.96 21.75,70.8 28.89,70.8 29.21,70.48 IC20.6 29.21,67.15 29.05,66.99 | v24.77,48.9 25.72,48.9 26.04,49.21 50.48,49.21 50.8,49.53 IC2.8 | 29.05,66.99 | 29.05,66.99 28.89,66.83 23.18,66.83 v22.86,67.15
COL7  (via drill 0.3)
  Top 0.254: IC20.13 19.05,73.34 20.16,72.23 | 20.16,72.23 | 20.16,72.23 20.32,72.07 v20.32,70.33 | IC4.20 35.4,34.29 36.51,35.4 45.24,35.4 45.88,36.04 45.88,43.5 45.24,44.13 45.24,44.77 45.88,45.4 45.88,46.83 45.72,46.99 v45.56,46.99 | v26.67,71.75 IC20.5 | v55.4,72.07 | v55.4,72.07 55.24,71.91 55.24,65.56 56.83,65.56 56.83,62.87 55.72,61.75 55.72,56.67 55.24,56.2 55.24,47.15 v55.4,47.15
  Bottom 0.254: v20.32,70.33 26.19,70.33 26.67,69.85 IC20.5 | v45.56,46.99 IC2.9 55.24,46.99 v55.4,47.15 | v26.67,71.75 26.67,71.91 26.83,72.07 v55.4,72.07
D0  (via drill 0.3)
  Top 0.254: v63.5,23.97 v63.5,49.53
  Bottom 0.254: IC3.33 81.12,49.53 80.17,48.58 70.33,48.58 69.37,49.53 IC2.33 v63.5,49.53 | SV1.5 8.41,27.94 9.05,27.3 9.05,22.38 9.53,21.91 49.85,21.91 50.48,22.54 58.74,22.54 59.85,23.65 63.18,23.65 v63.5,23.97 | v63.5,23.97
D1  (via drill 0.3)
  Top 0.254: v64.29,24.45 | v64.29,24.45 63.98,24.77 63.98,46.67 v64.29,46.99
  Bottom 0.254: IC3.32 88.74,46.99 87.79,46.04 77.63,46.04 76.68,46.99 IC2.32 v64.29,46.99 | SV1.6 5.56,27.94 6.67,29.05 8.73,29.05 9.37,28.42 | 9.37,28.42 | 9.37,28.42 9.53,28.26 9.53,22.7 9.84,22.38 49.69,22.38 50.32,23.02 58.58,23.02 59.69,24.13 62.55,24.13 63.34,24.77 63.82,24.77 63.98,24.77 64.14,24.61 v64.29,24.45
D2  (via drill 0.3)
  Top 0.254: v64.61,25.4 64.45,25.56 64.45,44.13 v64.77,44.45
  Bottom 0.254: IC3.31 81.44,44.45 80.49,43.5 76.83,43.5 75.88,44.45 IC2.31 v64.77,44.45 | SV1.7 8.57,30.48 9.84,29.21 10,29.05 10,23.02 10.16,22.86 48.58,22.86 50.8,25.08 62.87,25.08 63.34,25.4 v64.61,25.4
D3  (via drill 0.3)
  Top 0.254: v62.71,25.88 63.02,26.35 63.02,41.59 v62.71,41.91
  Bottom 0.254: IC3.30 81.6,41.91 80.64,40.96 76.83,40.96 75.88,41.91 IC2.30 v62.71,41.91 | SV1.8 5.87,30.48 6.99,31.59 9.53,31.59 10.48,30.64 10.48,23.34 48.42,23.34 50.64,25.56 62.39,25.56 v62.71,25.88
D4  (via drill 0.3)
  Top 0.254: v92.39,27.94 92.39,38.58 93.19,39.37 IC3.29
  Bottom 0.254: IC3.29 81.6,39.37 80.64,38.42 76.83,38.42 75.88,39.37 IC2.29 | SV1.9 9.05,33.02 10.95,31.11 10.95,23.81 46.83,23.81 50.64,27.62 92.23,27.62 v92.39,27.94
D5  (via drill 0.3)
  Top 0.254: v62.23,28.42 62.55,28.42 62.55,28.57 62.55,36.51 v62.23,36.83
  Bottom 0.254: IC3.28 81.76,36.83 80.8,35.88 76.83,35.88 75.88,36.83 IC2.28 v62.23,36.83 | SV1.10 5.56,33.02 6.67,34.13 8.73,34.13 11.43,31.43 11.43,24.29 46.67,24.29 50.48,28.1 | 50.48,28.1 | 50.48,28.1 50.64,28.26 62.07,28.26 v62.23,28.42 | v62.23,28.42
D6  (via drill 0.3)
  Top 0.254: v69.06,30 69.06,33.18 67.94,34.29 IC2.27
  Bottom 0.254: IC3.27 81.6,34.29 80.64,33.34 76.99,33.34 76.04,34.29 IC2.27 | SV1.11 7.94,35.56 11.91,31.59 11.91,24.77 44.29,24.77 49.69,30.16 68.74,30.16 v69.06,30
D7
  Bottom 0.254: IC3.26 81.44,31.75 80.49,30.8 76.83,30.8 75.88,31.75 IC2.26 65.88,31.75 64.77,30.64 49.37,30.64 43.97,25.24 12.38,25.24 12.38,31.91 8.73,35.56 8.73,36.35 8.26,36.83 6.99,36.83 5.71,35.56 SV1.12
DATA  (via drill 0.3)
  Top 0.254: v86.36,48.1 X3.5
  Top 0.406: Q7.D 78.11,80.01 78.74,80.64 D6.C | X3.5 88.27,75.56 v88.27,84.45 88.27,90.81 R28.1
  Bottom 0.254: v86.36,48.1 86.2,48.26 81.44,48.26 80.17,46.99 IC3.9
  Bottom 0.406: D6.C D5.A 81.92,88.27 84.45,88.27 v88.27,84.45
DATA_OUT  (via drill 0.3)
  Top 0.254: v72.87,53.18 72.87,72.07 72.39,72.55 R52.1
  Top 0.406: Q7.G 75.56,77.79 74.14,76.36 74.14,74.45 R52.1
  Bottom 0.254: IC3.7 76.83,52.07 75.72,53.18 v72.87,53.18
GND  (via drill 0.3, 0.6)  (2 unrouted)
  other vias: 19.53,59.21 15.24,72.39 57.31,19.05 70.8,19.21 42.55,17.78 18.41,31.75 88.27,68.58 57.78,41.91 2.54,60.33 21.91,49.37 19.53,55.88 22.86,12.7
  pour Bottom: 99.06,0 87.15,0 87.15,13.49 27.3,13.49 27.3,0 0,0 0,100.33 99.06,100.33
  pour Top: 0,0 27.3,0 27.3,13.49 87.15,13.49 87.15,-0.16 99.06,-0.16 99.06,100.01 0,100.01
JOYA0
  Top 0.254: X5.1 30.89,84.05 R35.1
JOYA1
  Top 0.254: R36.1 26.04,84.25 X5.2
JOYA2
  Top 0.254: R37.1 20.95,81.44 22.23,82.71 22.23,84.61 22.7,85.09 24.13,85.09 X5.3
JOYA3
  Top 0.254: R38.1 20.95,84.66 X5.4
JOYB0
  Top 0.254: X4.1 62.64,85.95 R14.1
JOYB1
  Top 0.254: X4.2 59.89,84.02 R15.1
JOYB2
  Top 0.254: R31.1 X4.3
JOYB3
  Top 0.254: X4.4 54.41,84.02 R32.1
KB_CLOCK  (via drill 0.3)
  Top 0.254: R41.1 11.91,66.81 11.91,71.12 12.27,71.48 X2.5 | v22.7,64.61 23.02,64.29 23.02,55.56 24.45,54.13 IC1.2
  Bottom 0.254: R41.1 22.54,64.77 v22.7,64.61
KB_DATA  (via drill 0.3)
  Top 0.254: R42.1 11.43,70.17 10.95,70.64 10.95,72.45 X2.1 | v17.46,51.44 17.3,51.44 16.67,52.07 16.67,53.98 15.88,54.77 15.88,55.4 16.19,55.72 16.19,63.82 v16.03,63.98
  Bottom 0.254: IC1.1 18.57,52.23 v17.46,51.44 | v16.03,63.98 15.88,63.82 12.38,63.82 R42.1
PA2  (via drill 0.3)
  Top 0.254: v76.99,14.29 76.99,59.37 77.31,59.69 IC3.4
  Bottom 0.254: CN2.M 74.97,12.42 v76.99,14.29
PB0  (via drill 0.3)
  Top 0.254: v76.36,45.09 75.25,43.97 75.25,41.59 74.77,41.12 74.77,39.21 74.3,38.73 74.3,36.83 74.45,36.67 74.45,17.78 v74.14,17.46
  Bottom 0.254: IC3.10 76.99,44.45 v76.36,45.09 | CN2.C 43.29,13.45 50.16,16.83 73.5,16.83 v74.14,17.46
PB1  (via drill 0.3)
  Top 0.254: v75.88,42.7 75.88,41.43 75.25,40.8 75.25,39.05 74.77,38.58 74.77,37.15 74.93,36.99 v74.93,16.51
  Bottom 0.254: IC3.11 76.68,41.91 v75.88,42.7 | v74.93,16.51 | v74.93,16.51 74.77,16.35 52.07,16.35 48.1,14.13 48.1,11.83 CN2.D
PB2  (via drill 0.3)
  Top 0.254: v75.88,40.16 75.88,38.89 75.25,38.26 75.25,37.47 75.41,37.31 75.41,16.99 v75.88,16.51
  Bottom 0.254: IC3.12 76.68,39.37 v75.88,40.16 | v75.88,16.51 75.25,15.88 53.98,15.88 51.21,13.11 CN2.E
PB3  (via drill 0.3)
  Top 0.254: v75.88,37.78 75.88,17.78 v76.2,17.46 | v76.2,17.46
  Bottom 0.254: IC3.13 76.83,36.83 v75.88,37.78 | CN2.F 55.17,12.31 58.26,15.4 76.04,15.4 76.68,16.03 76.68,16.99 v76.2,17.46
PB4  (via drill 0.3)
  Top 0.254: v60.64,13.97 60.64,14.45 60.33,14.76 60.33,34.92 v60.64,35.24
  Bottom 0.254: CN2.H 59.13,12.14 v60.64,13.97 | v60.64,35.24 75.72,35.24 76.68,34.29 IC3.14
PB5  (via drill 0.3)
  Top 0.254: v63.66,14.13 63.66,22.7 65.25,24.29 65.25,25.72 64.93,26.04 64.93,32.23 v65.09,32.38
  Bottom 0.254: CN2.J 63.09,13.56 v63.66,14.13 | v65.09,32.38 65.41,32.7 75.72,32.7 76.68,31.75 78.42,31.75 IC3.15
PB6  (via drill 0.3)
  Top 0.254: v68.9,14.13 68.9,27.78 70.8,29.69 v70.8,30
  Bottom 0.254: CN2.K 67.05,12.6 v68.9,14.13 | v70.8,30 70.8,29.84 70.96,29.69 76.36,29.69 76.83,29.21 IC3.16
PB7  (via drill 0.3)
  Top 0.254: v72.39,14.13 v72.39,26.51
  Bottom 0.254: CN2.L 71.01,12.75 v72.39,14.13 | v72.39,26.51 | v72.39,26.51 72.55,26.67 IC3.17
PHI2  (via drill 0.3)
  Top 0.254: v10.16,50.8 10,50.64 10,39.37 10.48,38.89 v10.79,38.58 | v62.23,38.26 62.07,38.26 61.44,37.62 61.44,36.51 62.07,35.88 62.07,29.69 v61.75,29.37
  Bottom 0.254: IC3.25 92.39,29.21 91.28,28.1 69.85,28.1 68.74,29.21 IC2.25 64.14,29.21 63.66,29.37 v61.75,29.37 | v10.16,50.8 SV1.23 | v10.79,38.58 11.11,38.26 42.86,38.26 43.18,38.58 49.85,38.58 50.16,38.26 v62.23,38.26
PIC_CLK  (via drill 0.3)
  Top 0.254: QG1.8 15.24,56.04 | 15.24,56.04 | 15.24,56.04 15.24,56.67 v15.56,56.99 | v26.83,56.99 | v26.83,56.99 26.99,57.15 IC1.16
  Bottom 0.254: v15.56,56.99 15.72,57.15 26.67,57.15 v26.83,56.99
PIC_RESET  (via drill 0.3)
  Top 0.254: S1.2 8.61,13.49 | 8.61,13.49 S1.1 8.61,18.77 12.7,22.86 12.7,50.01 v12.54,50.16 | 8.61,13.49 R43.1 | 8.61,13.49
  Bottom 0.254: v12.54,50.16 | v12.54,50.16 12.86,50.48 19.53,50.48 | 19.53,50.48 28.89,50.48 29.53,51.12 IC1.4 | C7.2 19.53,50.64 19.53,50.48
POTAX  (via drill 0.3)
  Top 0.254: X5.5 19.91,78.35 v20.16,78.11
  Bottom 0.254: v20.16,78.11 23.65,78.11 24.13,77.63 IC20.11
POTAY  (via drill 0.3)
  Top 0.254: v32.23,87.79 32.23,78.42 31.75,77.95 IC20.8
  Bottom 0.254: X5.9 21.29,88.25 21.75,87.79 v32.23,87.79
POTBX  (via drill 0.3)
  Top 0.254: IC20.4 v24.13,72.55 | v51.59,73.18 51.59,86.29 X4.5
  Bottom 0.254: v24.13,72.55 50.96,72.55 v51.59,73.18
POTBY  (via drill 0.3)
  Top 0.254: IC20.1 16.51,73.66 17.62,74.77 v17.62,78.74 | v52.7,79.06 53.02,79.38 53.02,88.89 X4.9
  Bottom 0.254: v17.62,78.74 17.94,79.06 v52.7,79.06
POTX  (via drill 0.3)
  Top 0.254: SV1.27 9.21,55.88 10,56.67 10,66.52 v10.32,66.83
  Bottom 0.254: IC20.3 IC20.2 19.05,67.47 18.41,66.83 v10.32,66.83
POTY  (via drill 0.3)
  Top 0.254: SV1.29 8.73,58.42 9.53,59.21 9.53,69.53 8.73,70.33 8.73,73.98 9.37,74.93 v12.06,74.93
  Bottom 0.254: IC20.9 IC20.10 26.67,75.88 26.67,75.09 26.04,74.45 15.56,74.45 15.08,74.93 v12.06,74.93
R/W  (via drill 0.3)
  Top 0.254: v3.17,20.64 2.7,20.64 2.54,20.8 2.54,22.07 2.7,22.23 2.7,40.32 v2.38,40.64 | v62.55,19.21 62.55,20.16 v63.02,20.64
  Bottom 0.254: IC3.22 81.28,21.59 80.33,20.64 77.31,20.64 76.36,21.59 IC2.22 66.04,21.59 65.25,20.8 63.18,20.8 v63.02,20.64 | v3.17,20.64 3.49,20.95 33.97,20.95 34.92,20 35.88,20 36.35,20.48 50.01,20.48 50.32,20.16 61.75,20.16 62.55,19.37 v62.55,19.21 | v2.38,40.64 SV1.16
ROW0  (via drill 0.3)
  Top 0.254: v45.56,31.75 45.88,32.07 45.88,33.02 46.35,33.5 46.35,44.13 v46.04,44.45 46.04,44.61 46.35,44.93 46.35,50.8 48.74,53.18 48.74,57.15 48.1,57.78 48.1,58.9 49.21,60.01 49.21,63.02 48.42,63.82 48.42,79.53 48.74,79.85 48.74,81.28 v48.58,81.44
  Bottom 0.254: IC4.18 v45.56,31.75 | v46.04,44.45 IC2.10 | v48.58,81.44 48.26,81.76 36.99,81.76 C45.2 34.29,83.19 R35.2
ROW1  (via drill 0.3)
  Top 0.254: v53.34,35.56 53.82,36.04 53.82,41.59 53.5,41.91 IC2.11 50.48,41.91 50.16,42.23 50.16,62.71 50.64,63.18 50.64,63.66 48.9,65.41 | 48.9,65.41 48.9,79.06 49.21,79.38 v49.21,82.23 | 48.9,65.41
  Bottom 0.254: IC4.17 32.38,35.08 32.7,35.4 53.18,35.4 v53.34,35.56 | v49.21,82.23 43.5,82.23 C44.2 41.91,83.82 | 41.91,83.82 | 41.91,83.82 41.75,83.98 | 41.75,83.98 | 41.75,83.98 41.59,84.14 34.77,84.14 33.97,84.93 29.69,84.93 R36.2
ROW2  (via drill 0.3)
  Top 0.254: v47.62,32.23 47.62,32.86 47.78,33.02 47.78,39.05 v48.1,39.37 | v24.29,78.42 23.65,78.42 23.5,78.58 R37.2 | v45.24,39.53 45.4,39.69 45.4,43.34 44.77,43.97 44.77,47.15 45.88,48.26 45.88,50.96 48.26,53.34 48.26,56.99 47.62,57.63 47.62,59.05 48.74,60.17 48.74,62.71 47.94,63.5 47.94,76.68 v47.62,76.99
  Bottom 0.254: IC4.16 32.38,32.23 33.02,32.86 46.99,32.86 v47.62,32.23 | IC2.12 v48.1,39.37 45.4,39.37 v45.24,39.53 | v24.29,78.42 24.45,78.58 34.45,78.58 34.92,78.11 C43.2 36.67,76.99 v47.62,76.99
ROW3  (via drill 0.3)
  Top 0.254: C42.2 35.72,80.64 36.67,79.69 36.67,62.71 35.56,61.59 35.56,46.99 | v33.5,36.35 33.5,37.62 34.13,38.26 35.56,38.26 36.35,39.05 36.35,46.2 35.56,46.99 | 35.56,46.99
  Bottom 0.254: IC4.15 29.84,34.77 30.96,35.88 33.81,35.88 | 33.81,35.88 48.1,35.88 49.05,36.83 IC2.13 | IC2.13 | R38.2 24.45,82.87 33.34,82.87 C42.2 | v33.5,36.35 33.5,36.2 33.81,35.88
ROW4  (via drill 0.3)
  Top 0.254: SV1.31 8.41,60.96 8.89,61.44 | 8.89,61.44 | 8.89,61.44 9.05,61.59 9.05,69.22 8.26,70.01 8.26,74.14 8.73,74.93 8.73,77.31 10.95,77.31 11.11,77.31 v11.11,80.8 | v17.78,60.96 17.62,60.8 17.62,55.88 18.1,55.4 v18.1,35.72
  Bottom 0.254: IC2.14 50.64,34.29 46.99,30.64 30.96,30.64 30.48,31.11 IC4.14 28.89,31.75 27.62,33.02 26.51,33.02 26.04,33.5 26.04,35.08 25.4,35.72 v18.1,35.72 | C46.2 41.43,79.53 28.57,79.53 | v11.11,80.8 15.56,80.8 16.83,79.53 28.57,79.53 | SV1.31 8.57,60.96 8.73,61.12 17.62,61.12 v17.78,60.96 | 28.57,79.53 R39.2
ROW5  (via drill 0.3)
  Top 0.254: IC2.15 51.91,31.75 v50.01,34.61
  Bottom 0.254: v50.01,34.61 49.85,34.29 48.9,33.34 28.26,33.34 IC4.13
ROW6  (via drill 0.3)
  Top 0.254: v53.82,33.66 54.13,33.34 54.13,30 53.34,29.21 IC2.16
  Bottom 0.254: IC4.12 27.62,31.75 29.21,30.16 47.31,30.16 50.48,33.34 53.5,33.34 v53.82,33.66
ROW7  (via drill 0.3)
  Top 0.254: IC2.17 50.32,26.67 49.53,27.46 49.53,33.97 v48.9,34.61 | v41.43,33.97 41.43,29.69 v41.27,29.53
  Bottom 0.254: v48.9,34.61 48.9,34.13 48.58,33.81 41.59,33.81 v41.43,33.97 | v41.27,29.53 41.12,29.69 25.88,29.69 24.77,30.8 IC4.11
SP1  (via drill 0.3)
  Top 0.254: CN2.5 51.21,14.06 54.61,14.45 54.61,34.13 54.29,34.45 54.29,56.52 54.77,56.99 54.77,63.5 v56.04,64.77
  Bottom 0.254: RN2.3 IC2.39 v56.04,64.77
SP2  (via drill 0.3)
  Top 0.254: v59.85,60.17 59.85,11.7 CN2.7
  Bottom 0.254: IC3.39 95.25,64.77 95.73,64.29 95.73,61.59 95.41,61.28 92.55,61.28 92.08,61.75 81.44,61.75 80.49,60.8 73.5,60.8 72.39,59.69 RN2.5 69.53,59.69 68.58,60.64 60.33,60.64 v59.85,60.17
SW_DATA  (via drill 0.3)
  Top 0.254: IC4.4 27.3,50.01 27.94,50.64 27.94,56.67 28.1,56.83 | 28.1,56.83 | 28.1,56.83 v28.26,56.99 | v34.61,56.99 IC1.13
  Bottom 0.254: v28.26,56.99 | v28.26,56.99 28.42,57.15 34.45,57.15 v34.61,56.99
TOD_50HZ  (via drill 0.3)
  Top 0.254: v35.4,21.11 35.4,28.26 33.81,29.84 33.81,34.92 32.7,36.04 32.7,38.89 34.45,40.64 35.24,40.64 35.88,41.27 35.88,46.04 34.61,47.31 IC1.6
  Bottom 0.254: IC3.19 76.99,21.59 76.52,22.07 68.9,22.07 68.42,22.54 66.2,22.54 65.41,21.75 | 65.41,21.75 | 65.41,21.75 64.93,21.27 56.04,21.27 55.72,21.59 IC2.19 50.48,21.59 50.32,21.43 35.72,21.43 v35.4,21.11
VCC  (via drill 0.6)
  Top 0.254: 38.73,13.34 38.73,11.58 CN2.2
  Top 0.406: R26.2 R52.2 | 63.66,78.11 63.5,77.95 | R29.1 R28.2 R25.2 D5.C | 66.36,82.55 R27.2
  Top 0.813: X2.4 2,78.33 1.91,78.42 | X5.7 26.77,97.89 26.99,98.11 | X4.7 58.52,98.01 58.42,98.11 | 76.2,98.11 D7.C | D5.C 81.28,97.79 80.96,98.11
  Top 1.016: 38.73,13.34 v37.47,15.24 C6.2 IC4.19
  Top 1.27: 63.66,78.11 65.25,79.53 66.36,80.64 66.36,82.55 66.36,85.57 65.56,86.36 65.56,98.11 | 63.5,77.95 R53.2 R54.2 v63.5,69.53 | IC2.1 C4.2 | 15.24,4.45 QG1.14 | 15.24,4.45 15.24,11.75 R43.2 10.79,16.19 10.79,19.05 13.97,22.23 R41.2 | C3.2 14.76,3.97 15.24,4.45 | R42.2 R24.2
  Top 1.676: SV1.32 SV1.34 SV1.33 1.91,63.5 1.91,78.42 1.91,87.47 4.6,90.17 | 4.6,90.17 7.3,90.17 10.16,93.03 10.16,98.11 26.99,98.11 58.42,98.11 65.56,98.11 76.2,98.11 80.96,98.11 | C5.+ 4.92,89.85 4.6,90.17
  Bottom 0.254: 71.12,69.53 RN2.1 | C1.2 29.37,62.71 29.37,62.23
  Bottom 0.406: R54.2 63.5,74.3 63.98,73.82 68.42,73.82 R26.2
  Bottom 0.813: IC20.14 16.51,78.42 15.08,79.85 11.29,79.85 X2.4
  Bottom 1.016: v37.47,15.24 11.75,15.24 R43.2
  Bottom 1.27: IC3.1 76.52,69.53 C2.2 71.12,69.53 v63.5,69.53 54.29,69.53 IC2.1 | SV1.33 8.89,62.23 R42.2 R41.2 29.37,62.23 32.07,62.23 IC1.14

### Text on the board
tPlace: PORTA | PORTB | SERIAL | KEYBOARD | SPC64 1.0 2019 | CIA 1 | CIA 2 | RESET